# Altium schematic sheet P10_ETH0 RGMII.SchDoc
size 420 x 297 mm
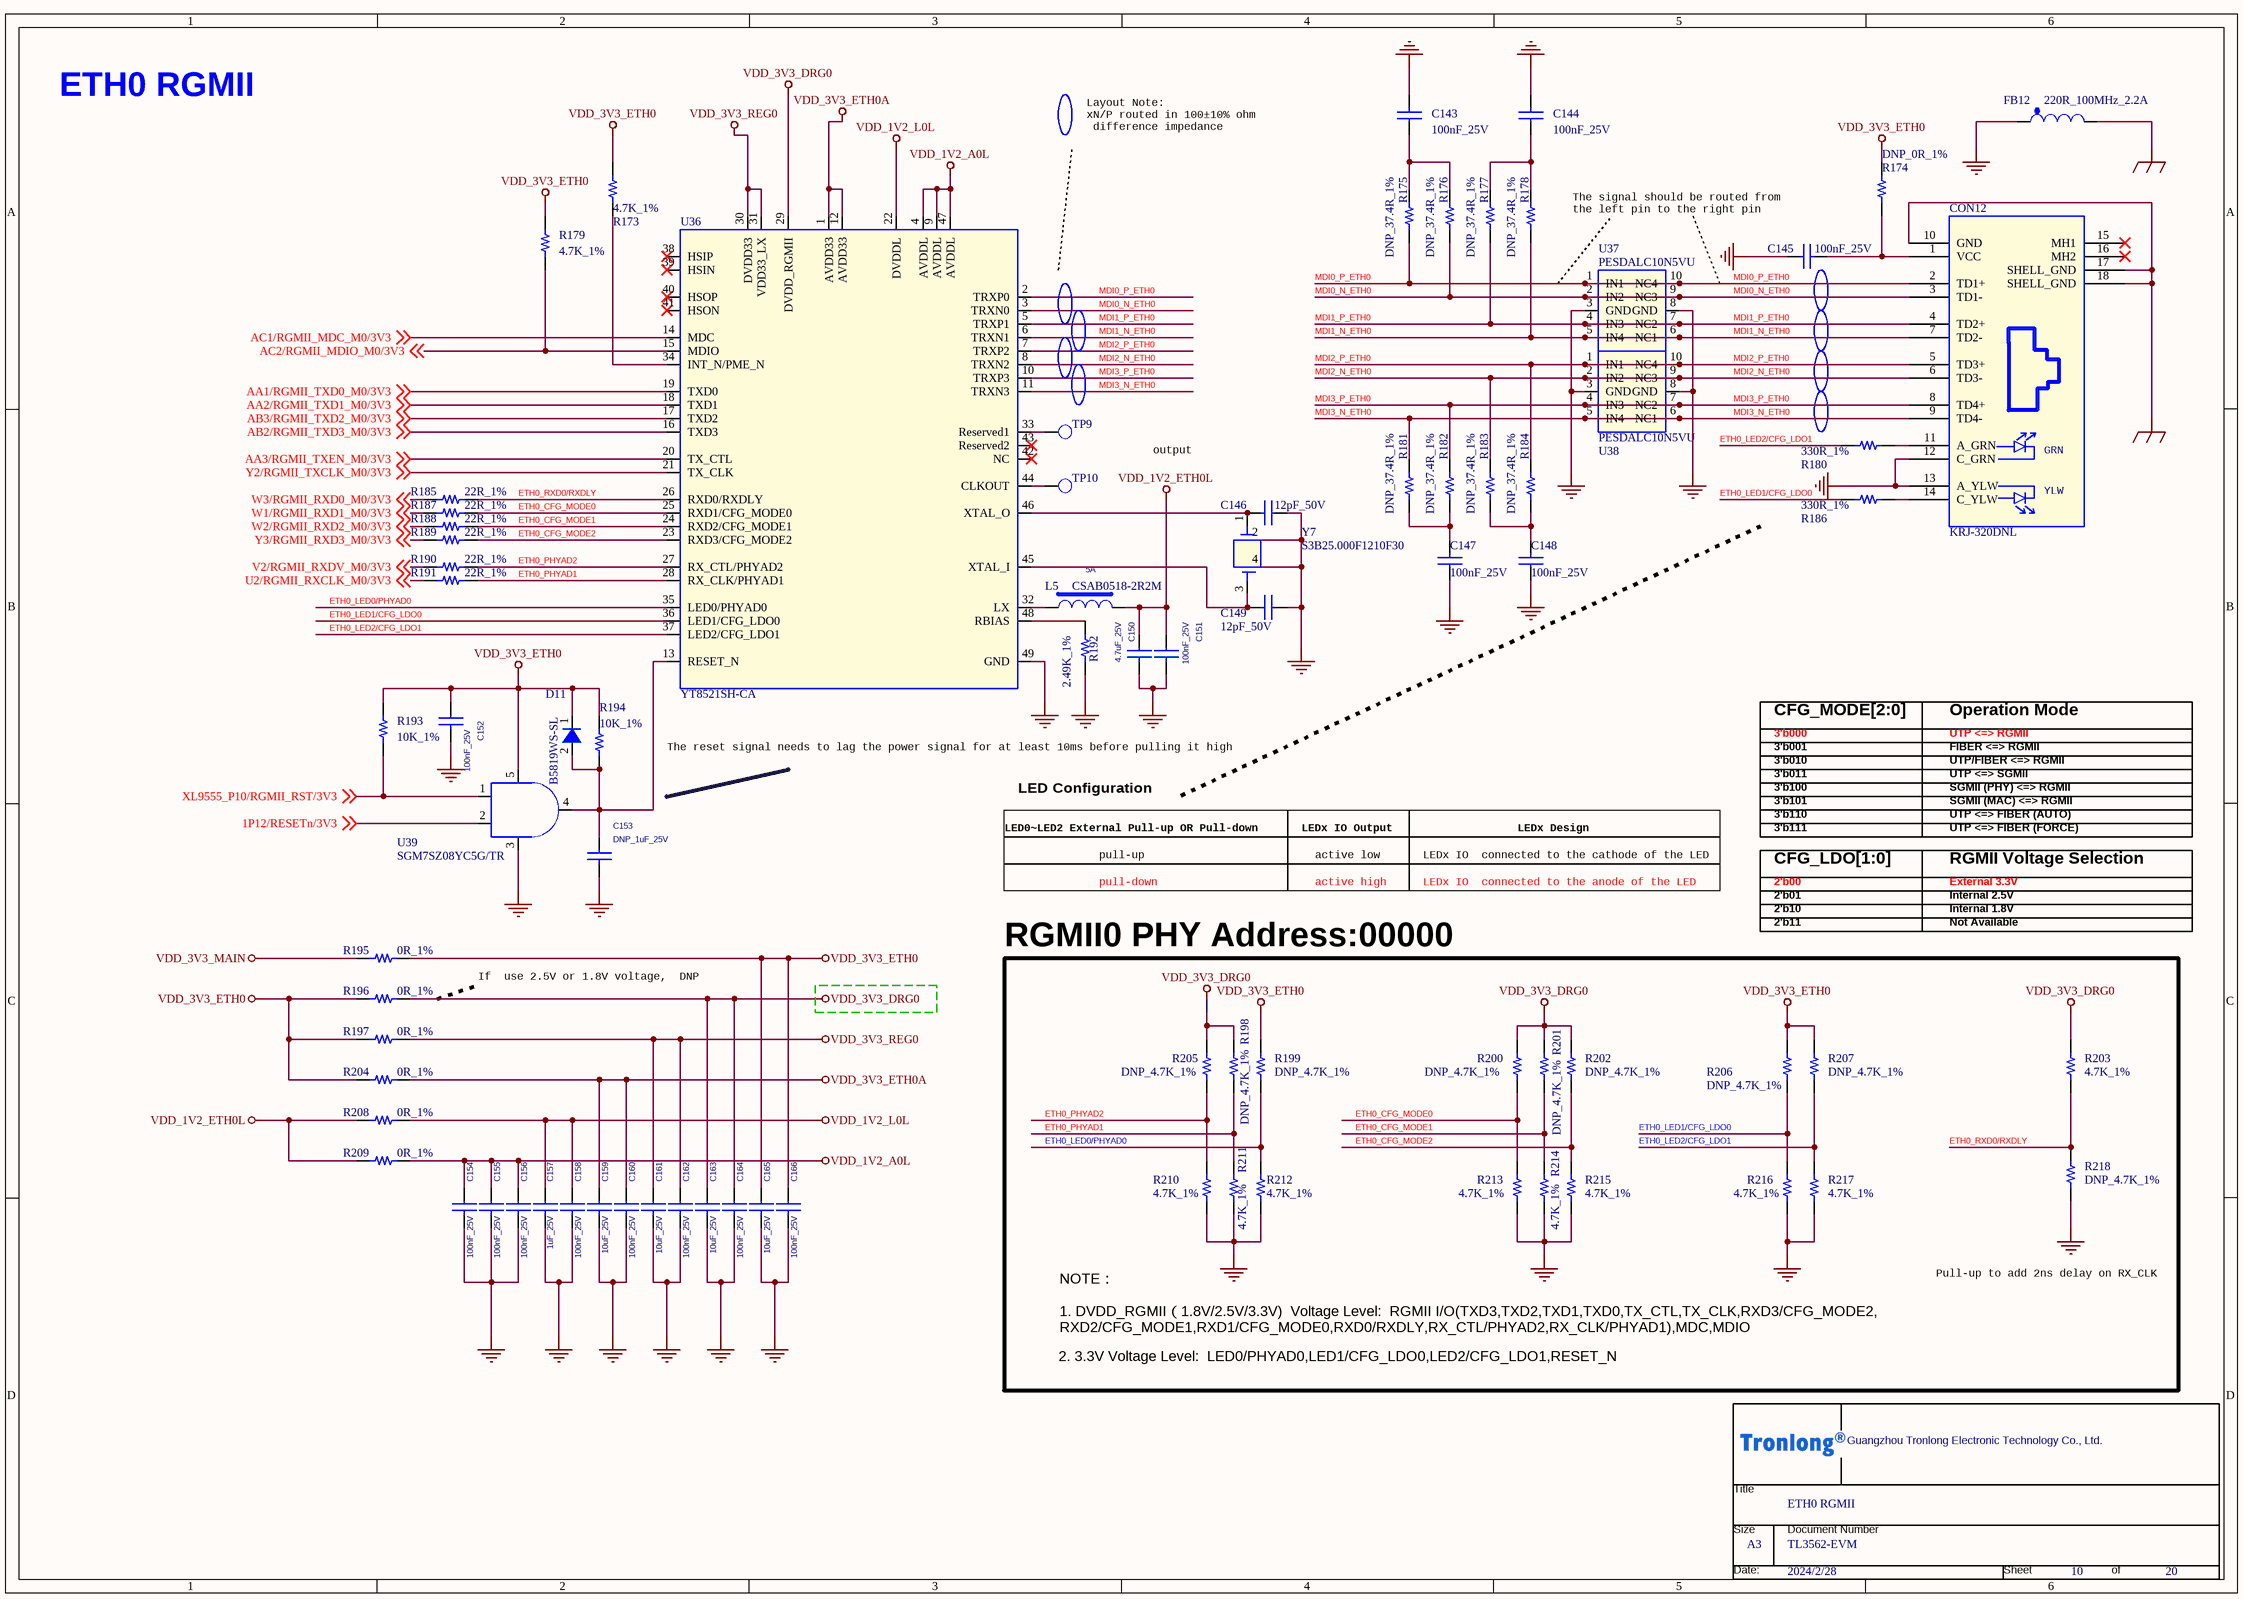
[diagram p0: P10_ETH0 RGMII.SchDoc]

## Parts
*  Page Count: 20  Page Number: 10  Page Size: A3  OrgName: Guangzhou Tronlong Electronic Technology Co., Ltd.  Title: ETH0 RGMII  Doc: TL3562-EVM  Page Modify Date: 2024/2/28  (hidden comment: Tronlong_TITTLE_20211115)  (graphical)
C143  100nF_25V  [C0402]
C144  100nF_25V  [C0402]
C145  100nF_25V  [C0402]
C146  12pF_50V  [C0402]
C147  100nF_25V  [C0402]
C148  100nF_25V  [C0402]
C149  12pF_50V  [C0402]
C150  4.7uF_25V  [C0603]
C151  100nF_25V  [C0402]
C152  100nF_25V  [C0402]
C153  DNP_1uF_25V  [C0603]
C154  100nF_25V  [C0402]
C155  100nF_25V  [C0402]
C156  100nF_25V  [C0402]
C157  1uF_25V  [C0603]
C158  100nF_25V  [C0402]
C159  10uF_25V  [C0603]
C160  100nF_25V  [C0402]
C161  10uF_25V  [C0603]
C162  100nF_25V  [C0402]
C163  10uF_25V  [C0603]
C164  100nF_25V  [C0402]
C165  10uF_25V  [C0603]
C166  100nF_25V  [C0402]
CON12  KRJ-320DNL  [KRJ-320DNL_14P]
D11  B5819WS-SL  [SOD-323]
FB12  220R_100MHz_2.2A  [L0603]
L5  CSAB0518-2R2M  Current: 5A  [SMD-L2520M-2P]
R173  4.7K_1%  [R0402]
R174  DNP_0R_1%  [R0402]
R175  DNP_37.4R_1%  [R0603]
R176  DNP_37.4R_1%  [R0603]
R177  DNP_37.4R_1%  [R0603]
R178  DNP_37.4R_1%  [R0603]
R179  4.7K_1%  [R0402]
R180  330R_1%  [R0402]
R181  DNP_37.4R_1%  [R0603]
R182  DNP_37.4R_1%  [R0603]
R183  DNP_37.4R_1%  [R0603]
R184  DNP_37.4R_1%  [R0603]
R185  22R_1%  [R0402]
R186  330R_1%  [R0402]
R187  22R_1%  [R0402]
R188  22R_1%  [R0402]
R189  22R_1%  [R0402]
R190  22R_1%  [R0402]
R191  22R_1%  [R0402]
R192  2.49K_1%  [R0603]
R193  10K_1%  [R0402]
R194  10K_1%  [R0402]
R195  0R_1%  [R0603]
R196  0R_1%  [R0603]
R197  0R_1%  [R0603]
R198  DNP_4.7K_1%  [R0402]
R199  DNP_4.7K_1%  [R0402]
R200  DNP_4.7K_1%  [R0402]
R201  DNP_4.7K_1%  [R0402]
R202  DNP_4.7K_1%  [R0402]
R203  4.7K_1%  [R0402]
R204  0R_1%  [R0603]
R205  DNP_4.7K_1%  [R0402]
R206  DNP_4.7K_1%  [R0402]
R207  DNP_4.7K_1%  [R0402]
R208  0R_1%  [R0603]
R209  0R_1%  [R0603]
R210  4.7K_1%  [R0402]
R211  4.7K_1%  [R0402]
R212  4.7K_1%  [R0402]
R213  4.7K_1%  [R0402]
R214  4.7K_1%  [R0402]
R215  4.7K_1%  [R0402]
R216  4.7K_1%  [R0402]
R217  4.7K_1%  [R0402]
R218  DNP_4.7K_1%  [R0402]
TP9  SMT TP  [TP30]  (value not drawn)
TP10  SMT TP  [TP30]  (value not drawn)
U36  YT8521SH-CA  [QFN48]
U37  PESDALC10N5VU  [DFN-10-2510]
U38  PESDALC10N5VU  [DFN-10-2510]
U39  SGM7SZ08YC5G/TR  [SC70-5-43M]
Y7  S3B25.000F1210F30  [SMD_3225]

## Blocks framed on the sheet
RGMII0 PHY Address:00000: R198-R203 R205-R207 R210-R218

## Nets
EGND: CON12.10(GND) CON12.17(SHELL_GND) CON12.18(SHELL_GND) FB12.2
GND: C143.2 C144.2 C145.1 C146.1 C147.1 C148.1 C149.1 C150.2 C151.2 C152.2 C153.2 C154.2 C155.2 C156.2 C157.2 C158.2 C159.2 C160.2 C161.2 C162.2 C163.2 C164.2 C165.2 C166.2 CON12.12(C_GRN) CON12.13(A_YLW) FB12.1 R192.1 R210.1 R211.1 R212.1 R213.1 R214.1 R215.1 R216.1 R217.1 R218.1 U36.49(GND) U37.3(GND) U37.8(GND) U38.3(GND) U38.8(GND) U39.3(GND) Y7.2 Y7.4
VDD_1V2_A0L: C154.1 C155.1 C156.1 R209.2 U36.4(AVDDL) U36.9(AVDDL) U36.47(AVDDL)
VDD_1V2_ETH0L: C150.1 C151.1 L5.2 R208.1 R209.1
VDD_1V2_L0L: C157.1 C158.1 R208.2 U36.22(DVDDL)
VDD_3V3_DRG0: C163.1 C164.1 R196.2 R198.2 R200.2 R201.2 R202.2 R203.2 R205.2 U36.29(DVDD_RGMII)
VDD_3V3_ETH0: C152.1 C165.1 C166.1 D11.1(Cathode) R173.2 R174.1 R179.1 R193.1 R194.2 R195.2 R196.1 R197.1 R199.2 R204.1 R206.2 R207.2 U39.5(VCC)
VDD_3V3_ETH0A: C159.1 C160.1 R204.2 U36.1(AVDD33) U36.12(AVDD33)
VDD_3V3_MAIN: R195.1
VDD_3V3_REG0: C161.1 C162.1 R197.2 U36.30(DVDD33) U36.31(VDD33_LX)
1P12/RESETn/3V3: U39.2(B) ; off-sheet 1P12/RESETn/3V3
AA1/RGMII_TXD0_M0/3V3: U36.19(TXD0) ; off-sheet AA1/RGMII_TXD0_M0/3V3
AA2/RGMII_TXD1_M0/3V3: U36.18(TXD1) ; off-sheet AA2/RGMII_TXD1_M0/3V3
AA3/RGMII_TXEN_M0/3V3: U36.20(TX_CTL) ; off-sheet AA3/RGMII_TXEN_M0/3V3
AB2/RGMII_TXD3_M0/3V3: U36.16(TXD3) ; off-sheet AB2/RGMII_TXD3_M0/3V3
AB3/RGMII_TXD2_M0/3V3: U36.17(TXD2) ; off-sheet AB3/RGMII_TXD2_M0/3V3
AC1/RGMII_MDC_M0/3V3: U36.14(MDC) ; off-sheet AC1/RGMII_MDC_M0/3V3
AC2/RGMII_MDIO_M0/3V3: R179.2 U36.15(MDIO) ; off-sheet AC2/RGMII_MDIO_M0/3V3
ETH0_CFG_MODE0: R187.2 R200.1 R213.2 U36.25(RXD1/CFG_MODE0)
ETH0_CFG_MODE1: R188.2 R201.1 R214.2 U36.24(RXD2/CFG_MODE1)
ETH0_CFG_MODE2: R189.2 R202.1 R215.2 U36.23(RXD3/CFG_MODE2)
ETH0_LED0/PHYAD0: R199.1 R212.2 U36.35(LED0/PHYAD0)
ETH0_LED1/CFG_LDO0: R186.1 R206.1 R216.2 U36.36(LED1/CFG_LDO0)
ETH0_LED2/CFG_LDO1: R180.1 R207.1 R217.2 U36.37(LED2/CFG_LDO1)
ETH0_PHYAD1: R191.2 R198.1 R211.2 U36.28(RX_CLK/PHYAD1)
ETH0_PHYAD2: R190.2 R205.1 R210.2 U36.27(RX_CTL/PHYAD2)
ETH0_RXD0/RXDLY: R185.2 R203.1 R218.2 U36.26(RXD0/RXDLY)
MDI0_N_ETH0: CON12.3(TD1-) R176.2 U36.3(TRXN0) U37.2(IN2) U37.9(NC3)
MDI0_P_ETH0: CON12.2(TD1+) R175.2 U36.2(TRXP0) U37.1(IN1) U37.10(NC4)
MDI1_N_ETH0: CON12.7(TD2-) R178.2 U36.6(TRXN1) U37.5(IN4) U37.6(NC1)
MDI1_P_ETH0: CON12.4(TD2+) R177.2 U36.5(TRXP1) U37.4(IN3) U37.7(NC2)
MDI2_N_ETH0: CON12.6(TD3-) R183.1 U36.8(TRXN2) U38.2(IN2) U38.9(NC3)
MDI2_P_ETH0: CON12.5(TD3+) R184.1 U36.7(TRXP2) U38.1(IN1) U38.10(NC4)
MDI3_N_ETH0: CON12.9(TD4-) R181.1 U36.11(TRXN3) U38.5(IN4) U38.6(NC1)
MDI3_P_ETH0: CON12.8(TD4+) R182.1 U36.10(TRXP3) U38.4(IN3) U38.7(NC2)
U2/RGMII_RXCLK_M0/3V3: R191.1 ; off-sheet U2/RGMII_RXCLK_M0/3V3
V2/RGMII_RXDV_M0/3V3: R190.1 ; off-sheet V2/RGMII_RXDV_M0/3V3
W1/RGMII_RXD1_M0/3V3: R187.1 ; off-sheet W1/RGMII_RXD1_M0/3V3
W2/RGMII_RXD2_M0/3V3: R188.1 ; off-sheet W2/RGMII_RXD2_M0/3V3
W3/RGMII_RXD0_M0/3V3: R185.1 ; off-sheet W3/RGMII_RXD0_M0/3V3
XL9555_P10/RGMII_RST/3V3: R193.2 U39.1(A) ; off-sheet XL9555_P10/RGMII_RST/3V3
Y2/RGMII_TXCLK_M0/3V3: U36.21(TX_CLK) ; off-sheet Y2/RGMII_TXCLK_M0/3V3
Y3/RGMII_RXD3_M0/3V3: R189.1 ; off-sheet Y3/RGMII_RXD3_M0/3V3
NetC143_1: C143.1 R175.1 R176.1
NetC144_1: C144.1 R177.1 R178.1
NetC145_2: C145.2 CON12.1(VCC) R174.2
NetC146_2: C146.2 U36.46(XTAL_O) Y7.1
NetC147_2: C147.2 R181.2 R182.2
NetC148_2: C148.2 R183.2 R184.2
NetC149_2: C149.2 U36.45(XTAL_I) Y7.3
NetC153_1: C153.1 D11.2(Anode) R194.1 U36.13(RESET_N) U39.4(Y)
NetCON12_11: CON12.11(A_GRN) R180.2
NetCON12_14: CON12.14(C_YLW) R186.2
NetL5_1: L5.1 U36.32(LX)
NetR173_1: R173.1 U36.34(INT_N/PME_N)
NetR192_2: R192.2 U36.48(RBIAS)
NetTP9_1: TP9.1(TP) U36.33(Reserved1)
NetTP10_1: TP10.1(TP) U36.44(CLKOUT)

Not connected (* = marked no-connect by the designer): CON12 15(MH1)* 16(MH2)*; U36 38(HSIP)* 39(HSIN)* 40(HSOP)* 41(HSON)* 42(NC)* 43(Reserved2)*

## Notes on the sheet
- ETH0 RGMII
- Layout Note:
  xN/P routed in 100±10% ohm
  difference impedance
- The signal should be routed from
  the left pin to the right pin
- output
- CFG_MODE[2:0]
- 3'b000
- UTP <=> RGMII
- Operation Mode
- The reset signal needs to lag the power signal for at least 10ms before pulling it high
- LED Configuration
- 3'b001
- 3'b010
- 3'b011
- 3'b100
- 3'b101
- FIBER <=> RGMII
- UTP/FIBER <=> RGMII
- UTP <=> SGMII
- SGMII (PHY) <=> RGMII
- SGMII (MAC) <=> RGMII
- LED0~LED2 External Pull-up OR Pull-down
- pull-up
- LEDx IO Output
- active low
- LEDx IO  connected to the cathode of the LED
- LEDx Design
- 3'b110
- 3'b111
- CFG_LDO[1:0]
- UTP <=> FIBER (AUTO)
- UTP <=> FIBER (FORCE)
- RGMII Voltage Selection
- pull-down
- active high
- LEDx IO  connected to the anode of the LED
- 2'b00
- 2'b01
- 2'b10
- 2'b11
- External 3.3V
- Internal 2.5V
- Internal 1.8V
- Not Available
- If  use 2.5V or 1.8V voltage,  DNP
- Pull-up to add 2ns delay on RX_CLK
- NOTE：
  1. DVDD_RGMII（1.8V/2.5V/3.3V)  Voltage Level:  RGMII I/O(TXD3,TXD2,TXD1,TXD0,TX_CTL,TX_CLK,RXD3/CFG_MODE2,
  RXD2/CFG_MODE1,RXD1/CFG_MODE0,RXD0/RXDLY,RX_CTL/PHYAD2,RX_CLK/PHYAD1),MDC,MDIO
- 2. 3.3V Voltage Level:  LED0/PHYAD0,LED1/CFG_LDO0,LED2/CFG_LDO1,RESET_N
- (in symbol KRJ-320DNL_1) GRN; YLW
- (in symbol Tronlong_TITTLE_20211115) Title; Size; Document Number; Date:; Sheet; of

## Library data of the parts
* = Tronlong_TITTLE_20211115: RevCode: A?; Page Create Date: March  8, 1995
C143-C145 C147 C148 C151 C152 C154-C156 C158 C160 C162 C164 C166 = CAP NP_Dup3: 贴片陶瓷电容,100nF,10%,25V,X5R; Manufacturer Character: 中国大陆; Operation Temperature（℃）: -55~85℃; As-Welded: /; PCB Footprint: C0402
C146 C149 = CAP NP_Dup3: 贴片陶瓷电容,12pF,5%,50V,COG; Manufacturer Character: 中国大陆; As-Welded: /; Operation Temperature（℃）: -55~125℃; PCB Footprint: C0402
C150 = CAP NP_Dup3: 贴片陶瓷电容,4.7uF,10%,25V,X5R; Manufacturer Character: 中国大陆; Operation Temperature（℃）: -55~85℃; As-Welded: /; PCB Footprint: C0603
C153 = CAP NP_Dup3: 贴片陶瓷电容,1uF,10%,25V,X5R; Manufacturer Character: 中国大陆; As-Welded: DNP; Operation Temperature（℃）: -55~85℃; PCB Footprint: C0603
C157 = CAP NP_Dup3: 贴片陶瓷电容,1uF,10%,25V,X5R; Manufacturer Character: 中国大陆; Operation Temperature（℃）: -55~85℃; As-Welded: /; PCB Footprint: C0603
C159 C161 C165 = CAP NP_Dup3: 贴片陶瓷电容,10uF,10%,10V,X5R; Manufacturer Character: 中国大陆; As-Welded: /; Operation Temperature（℃）: -55~85℃; PCB Footprint: C0603
C163 = CAP NP_Dup3: 贴片陶瓷电容,10uF,10%,10V,X5R; Manufacturer Character: 中国大陆; Operation Temperature（℃）: -55~85℃; As-Welded: /; PCB Footprint: C0603
CON12 = KRJ-320DNL_1: RJ45连接器,14PIN,90度,母座,插件; Manufacturer: 东莞市科优达电子科技有限公司（DGKYD）; Manufacturer Character: 中国大陆; As-Welded: /; Operation Temperature（℃）: -40~85℃; Manufacturer PartNumber: KRJ-320DNL; Temperature: -40~85℃; PCB Footprint: KRJ-320DNL_14P
D11 = Diode200mA250V: 肖特基二极管,VR=40V,IF=1A,VF=0.6V@1A; Mfr: On Semiconductor; MfrNum: MMSD103T1G; TIIntPartnumber: 1E0013; Manufacturer Character: 中国大陆; Manufacturer: 江苏长晶科技有限公司（JSCJ）; Descriptive_Text: Diode 200mA 250V 1.25V Forward Drop; Vendor: Digikey; Cost100: 0.23; Cost10K: 0.07; PCB Footprint: smd123; As-Welded: /; Operation Temperature（℃）: -55~125℃; PartName: Diode200mA250V; DescriptiveText: Diode 200mA 250V 1.25V Forward Drop; Temperature: -55~150; Manufacturer PartNumber: B5819WS-SL
FB12 = FERRITE BEAD_Dup2: 磁珠,50mΩ,2.2A,220R@100MHz; Manufacturer Character: 中国大陆; Manufacturer: 深圳顺络电子股份有限公司（Sunlord）; Manufacturer PartNumber: UPZ1608U221-2R2TF; As-Welded: /; Operation Temperature（℃）: -55~125℃; Temperature: -55~125; PCB Footprint: L0603
L5 = INDUCTOR: 贴片功率电感,2.2uH,0.035Ω,Isat=6.5A,Irms=5A; Manufacturer Character: 中国大陆; Manufacturer: 深圳市科达嘉电子有限公司（CODACA）; Parameter: L2520，奇力新一体成型电感，最大额定电流3A，内阻65毫欧，20%; PCB Footprint: SMD_CSAB0518; As-Welded: /; Operation Temperature（℃）: -40~125℃; Manufacturer PartNumber: CSAB0518-2R2M; Temperature: -40~125℃
R173 R179 R212 R214-R217 = Resistor_Dup3: 贴片电阻,4.7K,±1%,1/16W; Manufacturer Character: 中国大陆; CLASS: DISCRETE; As-Welded: /; Operation Temperature（℃）: -55~155℃; PCB Footprint: R0402
R174 = Resistor_Dup3: 贴片电阻,0R,±1%,1/16W; Manufacturer Character: 中国大陆; CLASS: DISCRETE; Operation Temperature（℃）: -55~155℃; As-Welded: DNP; PCB Footprint: R0402
R175-R178 R181-R184 = Resistor_Dup3: 37.4R,±1%,R0603,≥1/10W; Manufacturer Character: 中国大陆; CLASS: DISCRETE; Operation Temperature（℃）: -40~85℃; As-Welded: DNP; PCB Footprint: R0603
R180 R186 = Resistor_Dup3: 贴片电阻,330R,±1%,1/16W; Manufacturer Character: 中国大陆; CLASS: DISCRETE; Operation Temperature（℃）: -55~155℃; As-Welded: /; PCB Footprint: R0402
R185 R187-R191 = Resistor_Dup3: 贴片电阻,22R,±1%,1/16W; Manufacturer Character: 中国大陆; CLASS: DISCRETE; As-Welded: /; Operation Temperature（℃）: -55~155℃; room: RS232; PCB Footprint: R0402
R192 = Resistor_Dup3: 贴片电阻,2.49K,±1%,1/10W; Manufacturer Character: 中国大陆; CLASS: DISCRETE; Operation Temperature（℃）: -55~155℃; As-Welded: /; PCB Footprint: R0603
R193 R194 = Resistor_Dup3: 贴片电阻,10K,±1%,1/16W; Manufacturer Character: 中国大陆; CLASS: DISCRETE; As-Welded: /; Operation Temperature（℃）: -55~155℃; PCB Footprint: R0402
  R193: Temperature: –55~155℃
R195-R197 R204 R208 R209 = Resistor_Dup3: 0R,±1%,R0603,≥1/10W; Manufacturer Character: 中国大陆; CLASS: DISCRETE; Operation Temperature（℃）: -55~155℃; room: RS232; As-Welded: /; PCB Footprint: R0603
R198 R199 R201 R202 R205-R207 R218 = Resistor_Dup3: 贴片电阻,4.7K,±1%,1/16W; Manufacturer Character: 中国大陆; CLASS: DISCRETE; Operation Temperature（℃）: -55~155℃; As-Welded: DNP; PCB Footprint: R0402
R200 = Resistor_Dup3: 贴片电阻,4.7K,±1%,1/16W; Manufacturer Character: 中国大陆; CLASS: DISCRETE; As-Welded: DNP; Operation Temperature（℃）: -55~155℃; PCB Footprint: R0402
R203 R210 R211 R213 = Resistor_Dup3: 贴片电阻,4.7K,±1%,1/16W; Manufacturer Character: 中国大陆; CLASS: DISCRETE; Operation Temperature（℃）: -55~155℃; As-Welded: /; PCB Footprint: R0402
TP9 TP10 = T POINT R: Manufacturer Character: 中国大陆; CLASS: IC; AGILE_PN: 510-75618; CAD_APPROVED: Yes; As-Welded: /; PCB Footprint: TP30; HEIGHT: 0.1MM
U36 = YT8521S: 以太网收发器，RGMII/SGMII; Manufacturer: 苏州裕太微电子有限公司（Motorcomm）; Manufacturer Character: 中国大陆; As-Welded: /; Operation Temperature（℃）: -40~85℃; Manufacturer PartNumber: YT8521SH-CA; Temperature: -40~85; PCB Footprint: QFN48
U37 = SU099PGTR: 4通道超低电容瞬态抑制器; Manufacturer Character: 中国大陆; Manufacturer: 上海芯导电子科技有限公司（Prisemi）; Operation Temperature（℃）: -40~85℃; As-Welded: /; Manufacturer PartNumber: PESDALC10N5VU; Temperature: -55~150; PCB Footprint: DFN-10-2510
U38 = SU099PGTR: 4通道超低电容瞬态抑制器; Manufacturer: 上海芯导电子科技有限公司（Prisemi）; Manufacturer Character: 中国大陆; Operation Temperature（℃）: -40~85℃; As-Welded: /; Manufacturer PartNumber: PESDALC10N5VU; Temperature: -55~150; PCB Footprint: DFN-10-2510
U39 = 74LVC1G08: 1个两输入与门; Manufacturer: 圣邦微电子股份有限公司（SGMICRO）; Manufacturer Character: 中国大陆; As-Welded: /; Operation Temperature（℃）: -40~85℃; Manufacturer PartNumber: SGM7SZ08YC5G/TR; Temperature: -40~85℃; PCB Footprint: SC70-5-43M
Y7 = CRYSTAL-4 PIN: 四脚无源晶振,25MHz,±10ppm,12pF,30Ω,±30ppm; Manufacturer Character: 中国大陆; Manufacturer: 深圳市星通时频电子有限公司公司（JSCJ）; As-Welded: /; Operation Temperature（℃）: -40~85℃; Manufacturer PartNumber: S3B25.000F1210F30; Temperature: -40~85; PCB Footprint: SMD_3225